# EAGLE schematic DC_brake (EAGLE 7.4.0)
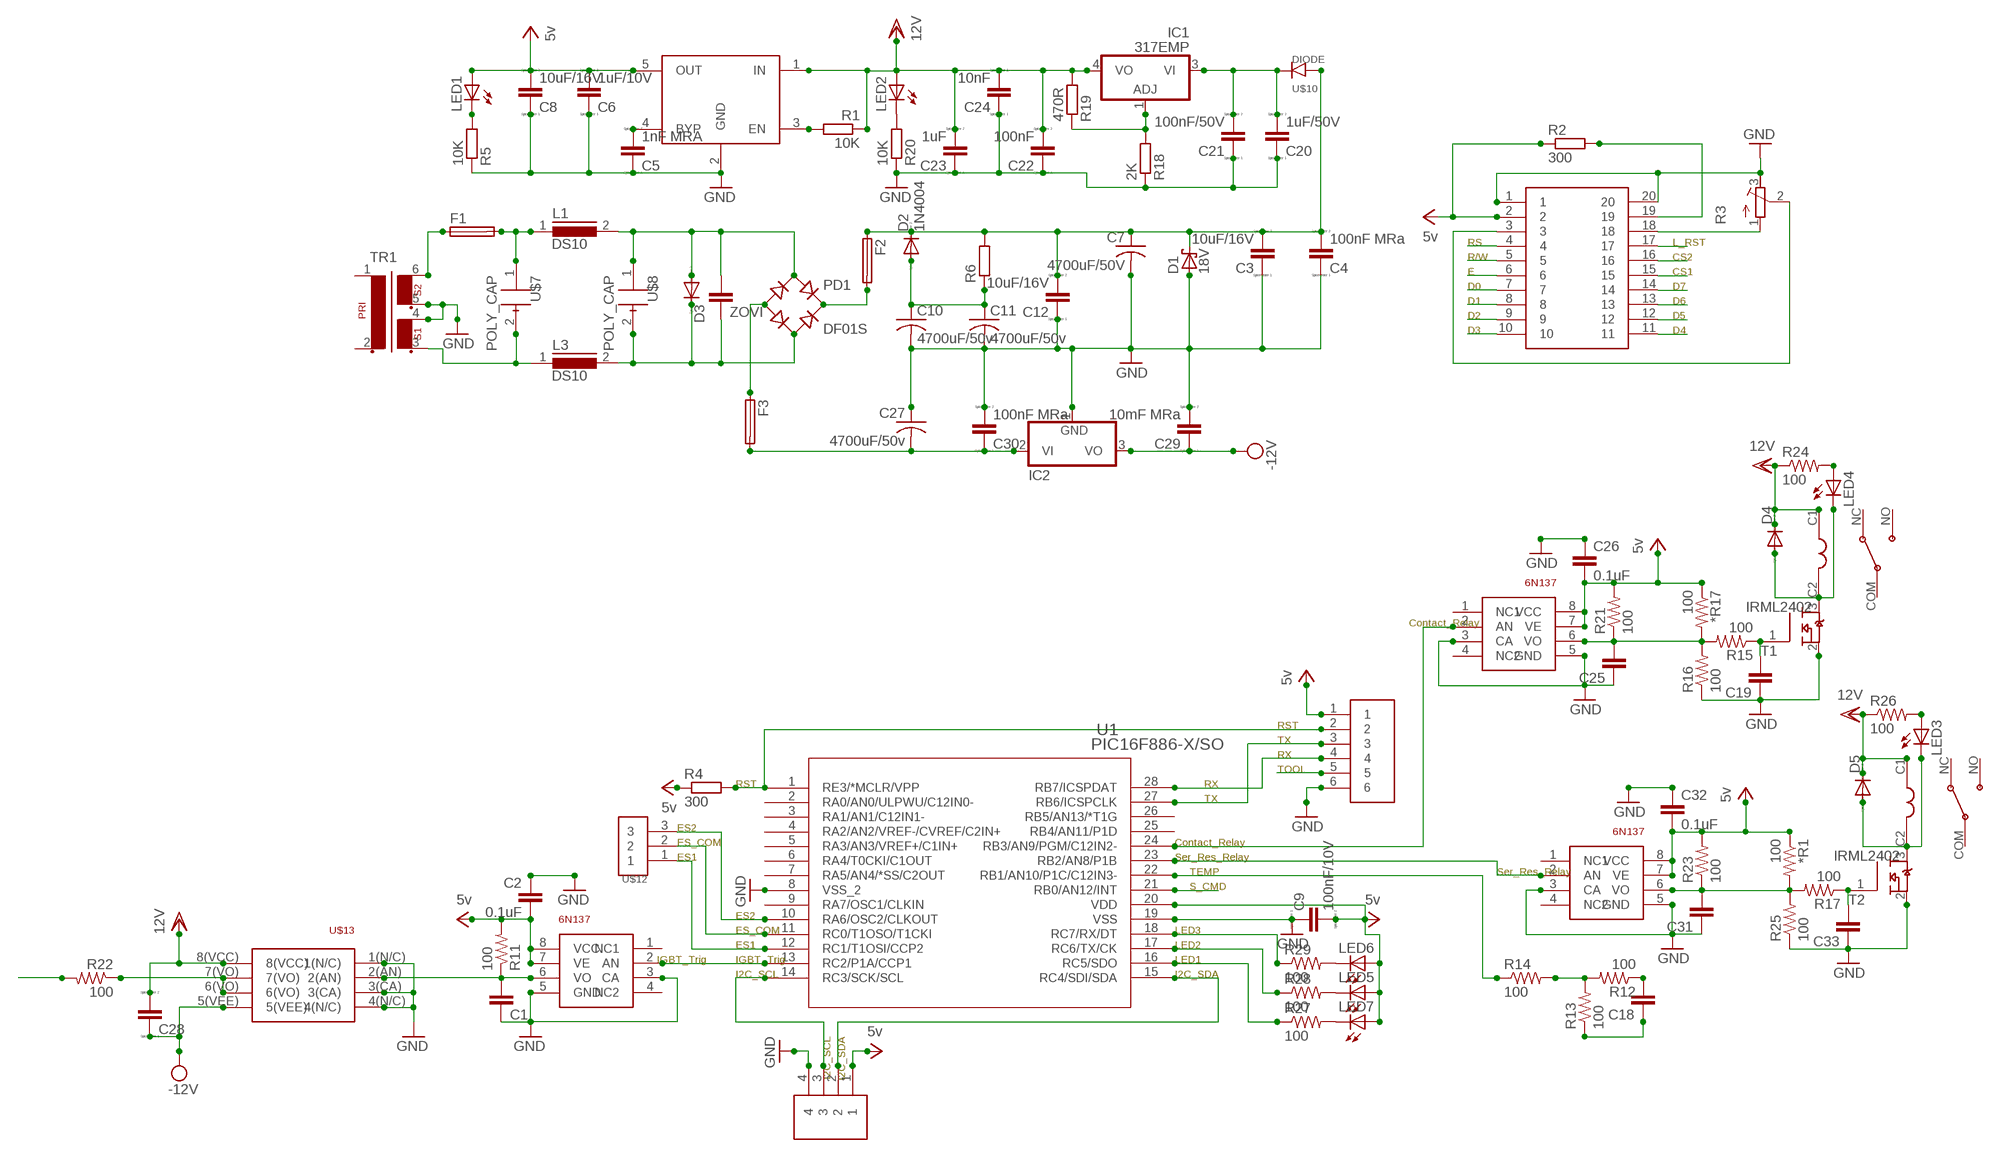
[diagram p0: schematic, sheet 1, part 1 of 2]
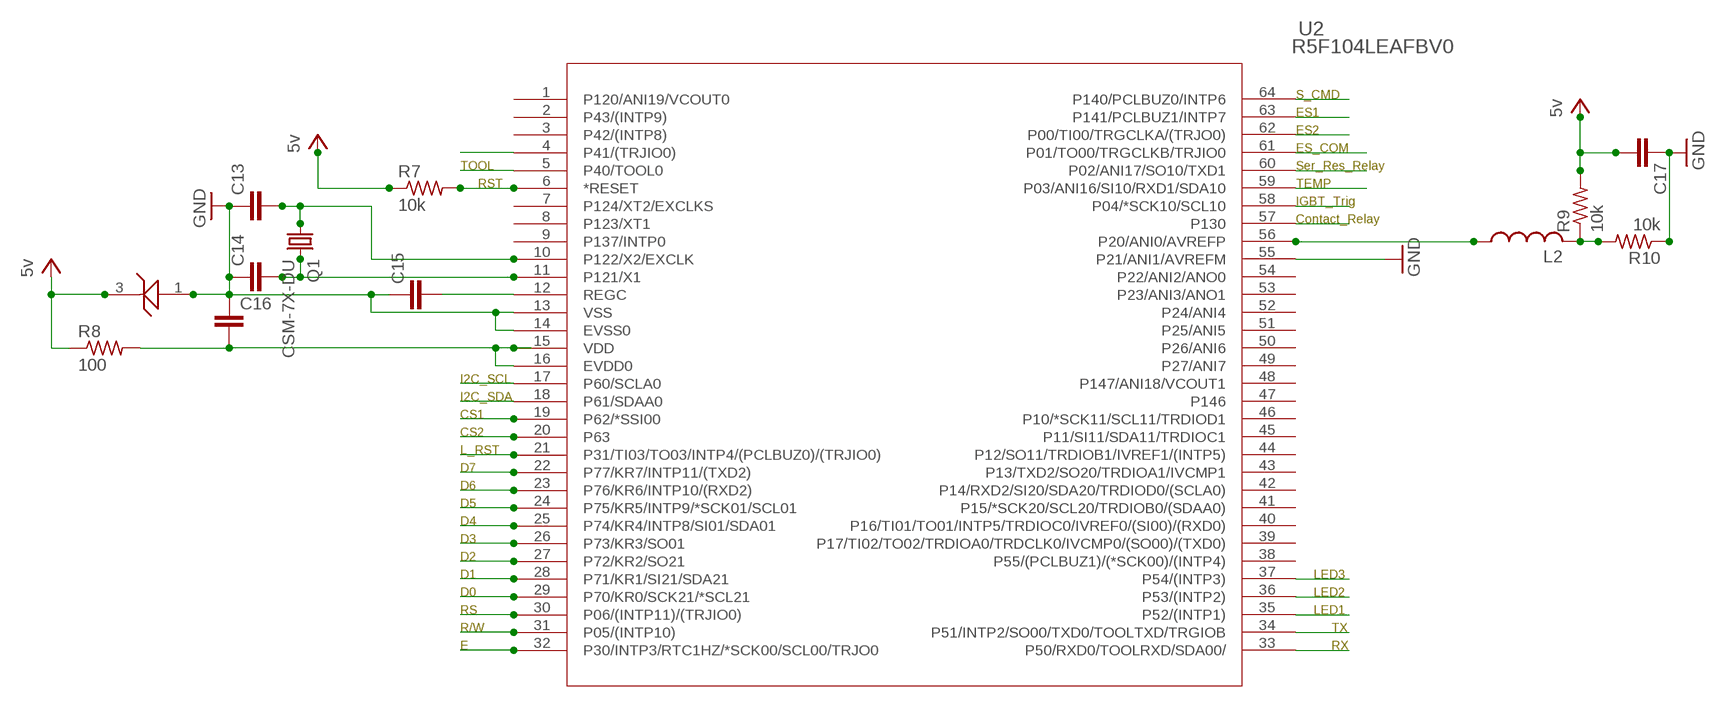
[diagram p1: schematic, sheet 1, part 2 of 2]

## Parts
*R1  100  R-US_R0603  [R0603]
*R17  100  R-US_R0603  [R0603]
C1  C-EUC0603  [C0603]
C2  0.1uF  C-EUC0603  [C0603]
C3  10uF/16V  CC1206  [C1206]
C4  100nF MRa  CC0603  [C0603]
C5  1nF MRA  CC0603  [C0603]
C6  1uF/10V  CC0603  [C0603]
C7  4700uF/50V  C-US050-075X075  [C050-075X075]
C8  10uF/16V  CC1206  [C1206]
C9  100nF/10V  CC0603  [C0603]
C10  4700uF/50v  C-US050-075X075  [C050-075X075]
C11  4700uF/50v  C-US050-075X075  [C050-075X075]
C12  10uF/16V  CC1206  [C1206]
C13  C-EUC0603  [C0603]
C14  C-EUC0603  [C0603]
C15  C-EUC0603  [C0603]
C16  C-EUC0603  [C0603]
C17  C-EUC0603  [C0603]
C18  C-EUC0603  [C0603]
C19  C-EUC0603  [C0603]
C20  1uF/50V  CC1206  [C1206]
C21  100nF/50V  CC0603  [C0603]
C22  100nF  CC0603  [C0603]
C23  1uF  CC0603  [C0603]
C24  10nF  CC0603  [C0603]
C25  C-EUC0603  [C0603]
C26  0.1uF  C-EUC0603  [C0603]
C27  4700uF/50v  C-US050-075X075  [C050-075X075]
C28  C  [C0805]
C29  10mF MRa  CC0603  [C0603]
C30  100nF MRa  CC0603  [C0603]
C31  C-EUC0603  [C0603]
C32  0.1uF  C-EUC0603  [C0603]
C33  C-EUC0603  [C0603]
D1  18V  SCHOTTKY-DIODESMC  [SMC]
D2  1N4004  [DO41-10]
D3  1N4933  [DO41-10]
D4  DIODE-DO214AC  [DO214AC]
D5  DIODE-DO214AC  [DO214AC]
F1  19560  [19560]
F2  19560  [19560]
F3  19560  [19560]
IC1  317EMP  [SOT223]
IC2  7908T  [TO220H]
L1  DS10  [DS10]
L2  L-USL4035M  [L4035M]
L3  DS10  [DS10]
LED1  LEDSML1206  [SML1206]
LED2  LEDSML1206  [SML1206]
LED3  LED3MM  [LED3MM]
LED4  LED3MM  [LED3MM]
LED5  LED3MM  [LED3MM]
LED6  LED3MM  [LED3MM]
LED7  LED3MM  [LED3MM]
PD1  DF01S  DBLS201G  [DBS]
Q1  CSM-7X-DU  [CSM-7X-DU]
R1  10K  R-EU_R0603  [R0603]
R2  300  R-EU_R0603  [R0603]
R3  R-TRIMM4G/J  [RTRIM4G/J]
R4  300  R-EU_R0603  [R0603]
R5  10K  R-EU_R0603  [R0603]
R6  R-EU_0411/12  [0411/12]
R7  10k  R-US_R0603  [R0603]
R8  100  R-US_R0603  [R0603]
R9  10k  R-US_R0603  [R0603]
R10  10k  R-US_R0603  [R0603]
R11  100  R-US_R0603  [R0603]
R12  100  R-US_R0603  [R0603]
R13  100  R-US_R0603  [R0603]
R14  100  R-US_R0603  [R0603]
R15  100  R-US_R0603  [R0603]
R16  100  R-US_R0603  [R0603]
R17  100  R-US_R0603  [R0603]
R18  2K  R-EU_R0603  [R0603]
R19  470R  R-EU_R0603  [R0603]
R20  10K  R-EU_R0603  [R0603]
R21  100  R-US_R0603  [R0603]
R22  100  R-US_R0603  [R0603]
R23  100  R-US_R0603  [R0603]
R24  100  R-US_R0603  [R0603]
R25  100  R-US_R0603  [R0603]
R26  100  R-US_R0603  [R0603]
R27  100  R-US_R0603  [R0603]
R28  100  R-US_R0603  [R0603]
R29  100  R-US_R0603  [R0603]
T1  IRML2402  [IRML2402]
T2  IRML2402  [IRML2402]
TR1  VR04,5-2  [VR04,5-2]
U1  PIC16F886-X/SO  PIC16F883-X/SO  [SOIC28-W_MC]
U2  R5F104LEAFBV0  [LQFP64_10X10]
U$1  MIC5205-5.YMS  [SMD]
U$2  SM20B-SRDS-G-TF  [SM20B-SRDS-G-TF]
U$3  6N137  [6N137]
U$4  6PIN  [6PIN]
U$5  ZENER  [ZENER]
U$6  4PIN  [4PIN]
U$7  POLY_CAP  [POL_CAP]
U$8  POLY_CAP  [POL_CAP]
U$9  RELAY  [RELAY]
U$10  DIODE  [DIODE]
U$11  6N137  [6N137]
U$12  3PIN  [3PIN]
U$13  HCPL-3120  [HCPL-3120]
U$14  6N137  [6N137]
U$15  RELAY  [RELAY]
ZOVI  C5/7.2  [C5B7.2]

## Nets
CONTACT_RELAY: U1.24(RB3/AN9/PGM/C12IN2-) U2.57(P130) U$11.2(AN)
CS1: U$2.15
CS2: U$2.16
D0: U2.29(P70/KR0/SCK21/*SCL21) U$2.7
D1: U2.28(P71/KR1/SI21/SDA21) U$2.8
D2: U2.27(P72/KR2/SO21) U$2.9
D3: U2.26(P73/KR3/SO01) U$2.10
D4: U2.25(P74/KR4/INTP8/SI01/SDA01) U$2.11
D5: U2.24(P75/KR5/INTP9/*SCK01/SCL01) U$2.12
D6: U2.23(P76/KR6/INTP10/(RXD2)) U$2.13
D7: U2.22(P77/KR7/INTP11/(TXD2)) U$2.14
ES1: U1.12(RC1/T1OSI/CCP2) U2.63(P141/PCLBUZ1/INTP7) U$12.1
ES2: U1.10(RA6/OSC2/CLKOUT) U2.62(P00/TI00/TRGCLKA/(TRJO0)) U$12.3
ES_COM: U1.11(RC0/T1OSO/T1CKI) U2.61(P01/TO00/TRGCLKB/TRJIO0) U$12.2
GND: C1.1 C2.1 C3.1 C4.1 C5.1 C6.1 C7.2 C8.1 C9.1 C10.2 C11.2 C12.1 C13.1 C14.1 C15.1 C16.1 C17.1 C19.1 C20.1 C21.1 C22.1 C23.1 C24.1 C25.1 C26.1 C27.1 C29.2 C31.1 C32.1 C33.1 D1.A IC2.1(GND) R3.3(E) R5.1 R10.1 R16.1 R18.1 R20.1 R25.1 T1.2(S1) T2.2(S1) TR1.4 TR1.5 U1.8(VSS_2) U1.19(VSS) U2.13(VSS) U2.14(EVSS0) U2.55(P21/ANI1/AVREFM) U$1.2(GND) U$2.1 U$2.20 U$3.3(CA) U$3.5(GND) U$4.6 U$5.1 U$6.4 U$11.3(CA) U$11.5(GND) U$13.1(N/C) U$13.3(CA) U$13.4(N/C) U$14.3(CA) U$14.5(GND)
I2C_SCL: U1.14(RC3/SCK/SCL) U2.17(P60/SCLA0) U$6.3
I2C_SDA: U1.15(RC4/SDI/SDA) U2.18(P61/SDAA0) U$6.2
IGBT_TRIG: U1.13(RC2/P1A/CCP1) U2.58(P04/*SCK10/SCL10) U$2.6 U$3.2(AN)
L_RST: U$2.17
LED1: R27.1 U1.16(RC5/SDO) U2.35(P52/(INTP1))
LED2: R28.1 U1.17(RC6/TX/CK) U2.36(P53/(INTP2))
LED3: R29.1 U1.18(RC7/RX/DT) U2.37(P54/(INTP3))
N$1: C30.2
N$2: C5.2 U$1.4(BYP)
N$3: F1.2 L1.1 U$7.1
N$4: R1.2 U$1.3(EN)
N$5: L3.1 TR1.3 U$7.2
N$6: F1.1 TR1.6
N$7: R3.2(S) U$2.3
N$8: R3.1(A) U$2.18
N$9: C18.1 R13.1
N$10: C10.1 C11.1 D2.A R6.1
N$11: U2.4(P41/(TRJIO0))
N$13: C3.2 C4.2 C7.1 C12.2 D1.C D2.C F2.1 R6.2 U$10.-
N$14: LED1.C R5.2
N$15: C13.2 Q1.1 U2.10(P122/X2/EXCLK)
N$16: C14.2 Q1.2 U2.11(P121/X1)
N$17: C16.2 R8.2 U2.15(VDD) U2.16(EVDD0)
N$18: C15.2 U2.12(REGC)
N$19: U2.21(P31/TI03/TO03/INTP4/(PCLBUZ0)/(TRJIO0))
N$20: U2.20(P63)
N$21: R2.2 U$2.19
N$22: U2.19(P62/*SSI00)
N$23: U2.30(P06/(INTP11)/(TRJIO0))
N$24: U2.31(P05/(INTP10))
N$25: U2.32(P30/INTP3/RTC1HZ/*SCK00/SCL00/TRJO0)
N$26: L2.2 R9.1 R10.2
N$27: D3.A L1.2 PD1.AC1 U$8.1 ZOVI.2
N$28: D3.C L3.2 PD1.AC2 U$8.2 ZOVI.1
N$29: L2.1 U2.56(P20/ANI0/AVREFP)
N$31: C1.2 R11.1 U$3.6(VO) U$13.2(AN)
N$32: R22.2
N$33: C18.2 R12.1
N$35: F2.2 PD1.+
N$36: F3.1 PD1.-
N$37: R12.2 R13.2 R14.2
N$38: C19.2 R15.1 T1.1(G1)
N$39: D4.A LED4.K(C) T1.3(D1) U$9.C2
N$40: C33.2 R17.1 T2.1(G1)
N$41: *R17.2 C25.2 R15.2 R16.2 R21.1 U$11.6(VO)
N$42: LED2.C R20.2
N$43: IC1.1(ADJ) R18.2 R19.1
N$44: C20.2 C21.2 IC1.3(VI) U$10.+
N$45: C27.2 C30.1 F3.2 IC2.2(VI)
N$47: R22.1 U$13.6(VO) U$13.7(VO)
N$48: *R1.2 C31.2 R17.2 R23.1 R25.2 U$14.6(VO)
N$50: LED4.A R24.2
N$51: D5.A LED3.K(C) T2.3(D1) U$15.C2
N$52: LED7.K(C) R27.2
N$53: LED3.A R26.2
N$54: LED5.K(C) R28.2
N$55: LED6.K(C) R29.2
R/W: U$2.5
RS: U$2.4
RST: R4.2 R7.2 U1.1(RE3/*MCLR/VPP) U2.6(*RESET) U$4.2
RX: U1.28(RB7/ICSPDAT) U2.33(P50/RXD0/TOOLRXD/SDA00/) U$4.4
S_CMD: U1.21(RB0/AN12/INT) U2.64(P140/PCLBUZ0/INTP6)
SER_RES_RELAY: U1.23(RB2/AN8/P1B) U2.60(P02/ANI17/SO10/TXD1) U$14.2(AN)
TEMP: R14.1 U1.22(RB1/AN10/P1C/C12IN3-) U2.59(P03/ANI16/SI10/RXD1/SDA10)
TOOL: U2.5(P40/TOOL0) U$4.5
TX: U1.27(RB6/ICSPCLK) U2.34(P51/INTP2/SO00/TXD0/TOOLTXD/TRGIOB) U$4.3
VCC: *R1.1 *R17.1 C2.2 C6.2 C8.2 C9.2 C17.2 C26.2 C32.2 LED1.A LED5.A LED6.A LED7.A R2.1 R4.1 R7.1 R8.1 R9.2 R11.2 R21.2 R23.2 U1.20(VDD) U$1.5(OUT) U$2.2 U$3.7(VE) U$3.8(VCC) U$4.1 U$5.3 U$6.1 U$11.7(VE) U$11.8(VCC) U$14.7(VE) U$14.8(VCC) ; supply symbol labelled 5v
VDD: C22.2 C23.2 C24.2 C28.1 C28.2 C29.1 D4.C D5.C IC1.4(VO) IC2.3(VO) LED2.A R1.1 R19.2 R24.1 R26.1 U$1.1(IN) U$9.C1 U$13.5(VEE) U$13.8(VCC) U$15.C1 ; supply symbol labelled 12V, -12V
Unconnected: TR1.1 TR1.2 U1.2(RA0/AN0/ULPWU/C12IN0-) U1.3(RA1/AN1/C12IN1-) U1.4(RA2/AN2/VREF-/CVREF/C2IN+) U1.5(RA3/AN3/VREF+/C1IN+) U1.6(RA4/T0CKI/C1OUT) U1.7(RA5/AN4/*SS/C2OUT) U1.9(RA7/OSC1/CLKIN) U1.25(RB4/AN11/P1D) U1.26(RB5/AN13/*T1G) U2.1(P120/ANI19/VCOUT0) U2.2(P43/(INTP9)) U2.3(P42/(INTP8)) U2.7(P124/XT2/EXCLKS) U2.8(P123/XT1) U2.9(P137/INTP0) U2.38(P55/(PCLBUZ1)/(*SCK00)/(INTP4)) U2.39(P17/TI02/TO02/TRDIOA0/TRDCLK0/IVCMP0/(SO00)/(TXD0)) U2.40(P16/TI01/TO01/INTP5/TRDIOC0/IVREF0/(SI00)/(RXD0)) U2.41(P15/*SCK20/SCL20/TRDIOB0/(SDAA0)) U2.42(P14/RXD2/SI20/SDA20/TRDIOD0/(SCLA0)) U2.43(P13/TXD2/SO20/TRDIOA1/IVCMP1) U2.44(P12/SO11/TRDIOB1/IVREF1/(INTP5)) U2.45(P11/SI11/SDA11/TRDIOC1) U2.46(P10/*SCK11/SCL11/TRDIOD1) U2.47(P146) U2.48(P147/ANI18/VCOUT1) U2.49(P27/ANI7) U2.50(P26/ANI6) U2.51(P25/ANI5) U2.52(P24/ANI4) U2.53(P23/ANI3/ANO1) U2.54(P22/ANI2/ANO0) U$3.1(NC1) U$3.4(NC2) U$9.COM U$9.NC U$9.NO U$11.1(NC1) U$11.4(NC2) U$14.1(NC1) U$14.4(NC2) U$15.COM U$15.NC U$15.NO

## Notes on the sheet
- RS | L_RST
- R/W | CS2
- E | CS1
- D0 | D7
- D1 | D6
- D2 | D5
- D3 | D4
- S_CMD
- ES1
- ES2
- ES_COM
- TOOL | Ser_Res_Relay
- RST | TEMP
- IGBT_Trig
- Contact_Relay
- Contact_Relay
- I2C_SCL
- I2C_SDA
- CS1
- CS2
- RST | L_RST
- TX | D7
- RX | D6
- TOOL | D5
- RST | RX | D4
- TX | D3
- D2
- ES2 | D1 | LED3
- ES_COM | Contact_Relay | D0 | LED2
- ES1 | Ser_Res_Relay | RS | LED1
- TEMP | Ser_Res_Relay | R/W | TX
- S_CMD | E | RX
- ES2
- ES_COM | LED3
- ES1 | LED2
- IGBT_Trig | IGBT_Trig | LED1
- I2C_SCL | I2C_SDA
- I2C_SCL | I2C_SDA

## Library data of the parts
*R1 *R17 R7-R17 R21-R29 = resistor:R-US_: RESISTOR, American symbol
C1 C2 C13-C19 C25 C26 C31-C33 = rcl:C-EU: CAPACITOR, European symbol
C3-C6 C8 C9 C12 C20-C24 C28-C30 = eagle-ltspice:C: CAPACITOR, European symbol; SPICEMODEL: NONE; SPICEPREFIX: C
C7 C10 C11 C27 = rcl:C-US: CAPACITOR, American symbol
D1 = diode:SCHOTTKY-DIODE: Schottky Diode
D2 = diode:1N4004: DIODE general purpose rectifier, 1 A
D3 = diode:1N4933: DIODE fast recovery rectifier, 1A
D4 D5 = diode:DIODE-: DIODE
F1-F3 = fuse:19560: FUSE HOLDER TR5, Wickmann; MPN: 56000001009; OC_FARNELL: 1185363; OC_NEWARK: 15P8392
IC1 = linear:*317: Positive VOLTAGE REGULATOR
IC2 = linear:79*: Negative VOLTAGE REGULATOR
L1 L3 = inductors:DS10: INDUCTOR
L2 = rcl:L-US: INDUCTOR, American symbol
LED1-LED7 = led:LED: LED OSRAM: - CHIPLED LG R971, LG N971, LY N971, LG Q971, LY Q971, LO R971, LY R971 LH N974, LH R974 LS Q976, LO Q976, LY Q976 LO Q996 - Hyper CHIPLED LW Q18S LB Q993, LB Q99A, LB R99A - SideLED LS A670, LO A670, LY A670, LG A670, LP A670 LB A673, LV A673, LT A673, LW A673 LH A674 LY A675 LS A676, LA A676, LO A676, LY A676, LW A676 LS A679, LY A679, LG A679 - Hyper Micro SIDELED® LS Y876, LA Y876, LO Y876, LY Y876 LT Y87S - SmartLED LW L88C, LW L88S LB L89C, LB L89S, LG L890 LS L89K, LO L89K, LY L89K LS L896, LA L896, LO L896, LY L896 - TOPLED LS T670, LO T670, LY T670, LG T670, LP T670 LSG T670, LSP T670, LSY T670, LOP T670, LYG T670 LG T671, LOG T671, LSG T671 LB T673, LV T673, LT T673, LW T673 LH T674 LS T676, LA T676, LO T676, LY T676, LB T676, LH T676, LSB T676, LW T676 LB T67C, LV T67C, LT T67C, LS T67K, LO T67K, LY T67K, LW E67C LS E67B, LA E67B, LO E67B, LY E67B, LB E67C, LV E67C, LT E67C LW T67C LS T679, LY T679, LG T679 LS T770, LO T770, LY T770, LG T770, LP T770 LB T773, LV T773, LT T773, LW T773 LH T774 LS E675, LA E675, LY E675, LS T675 LS T776, LA T776, LO T776, LY T776, LB T776 LHGB T686 LT T68C, LB T68C - Hyper Mini TOPLED® LB M676 - Mini TOPLED Santana® LG M470 LS M47K, LO M47K, LY M47K Source: http://www.osram.convergy.de LUXEON: - LUMILED® LXK2-PW12-R00, LXK2-PW12-S00, LXK2-PW14-U00, LXK2-PW14-V00 LXK2-PM12-R00, LXK2-PM12-S00, LXK2-PM14-U00 LXK2-PE12-Q00, LXK2-PE12-R00, LXK2-PE12-S00, LXK2-PE14-T00, LXK2-PE14-U00 LXK2-PB12-K00, LXK2-PB12-L00, LXK2-PB12-M00, LXK2-PB14-N00, LXK2-PB14-P00, LXK2-PB14-Q00 LXK2-PR12-L00, LXK2-PR12-M00, LXK2-PR14-Q00, LXK2-PR14-R00 LXK2-PD12-Q00, LXK2-PD12-R00, LXK2-PD12-S00 LXK2-PH12-R00, LXK2-PH12-S00 LXK2-PL12-P00, LXK2-PL12-Q00, LXK2-PL12-R00 Source: www.luxeon.com KINGBRIGHT: KA-3528ASYC Source: www.kingbright.com
PD1 = rectifier:DB?*G: Single Phase 1.0 AMP Glass Passivated Bridge Rectifier Taiwan Semiconductor Co.,Ltd. - TSC Source: http://www.taiwansemi.com/TSCbig5/ezcatfiles/cust/img/img/db101g.pdf http://www.ts.com.tw/db/pictures/modules/PDT/PDT060207001/DBLS201G.pdf
Q1 = crystal:CSM-7X-DU: SMD CRYSTAL Source: www.ecsxtal.com .. Crystal 3.6864MHz CSM_7X_DU.PDF; OC_FARNELL: unknown; OC_NEWARK: unknown
R1 R2 R4 R5 R18-R20 = rcl:R-EU_: RESISTOR, European symbol
R3 = rcl:R-TRIMM: Trimm resistor
R6 = resistor:R-EU_: RESISTOR, European symbol
T1 T2 = irlml2402:IRML2402
TR1 = trafo:VR04,5-2: TRANSFORMER 1 primary winding, 2 secondary windings, mounting holes BLOCK
U1 = pic16f883:PIC16F883-X/SO
U2 = r5f100lefb:R5F104LEAFBV0; 16-BITPWM: 10; 16-BITTIMERS: 7; 32KHZSUBCLOCK: Y; 8-BITPWM: 0; 8-BITTIMERS: 0; BIT-NESS: 16 Bit; CAN: 0; DATASHEETLINK: http://www.renesas.com/request?SCREEN_ID=ViewDocumentSearch&EXECUTE_ACTION=search&DOCUMENT_TYPE=VXNlcidzIE1hbnVhbDogSGFyZHdhcmU=&KEY_WORD=R5F104LEAFB#V0; DMACHANNELS: 0; DTC: 24; EXTERNALDATABUS: -; EXTERNALINTERRUPTS: 13; FAMILY: RL78; FPU: -; GROUP: 64; I2C: 7; IRDA: -; LIN: 1; LOWVOLTAGEDETECT: Y; MANUFACTURER_PART_NUMBER: R5F104LEAFB#V0; MOTORCONTROLPWMTIMER: Y; ON-CHIPOSCILLATOR: Y; ONCHIPDEBUG: Y; OP-AMPS: 0; OSCILLATIONSTOPDETECT: -; PACKAGE: LQFP; PACKAGECODE: GB-UEU; PINCOUNT: 64; PLL: -; POWERONRESET: Y; REALTIMECLOCK: Y; RENESASPACKAGECODE: P64GB-50-UEU-1; SERIES: RL78/G14; TEMPMAX: 85; TEMPMIN: -40; USART: 3; VCCMAX: 5.5; VCCMIN: 1.6; VENDOR: Renesas; WATCHDOGTIMERS: 1
U$1 = mic5205_5.0:MIC5205-5.YMS
U$2 = SM20B-SRDS-G-TF:SM20B-SRDS-G-TF
U$3 U$11 U$14 = 6n137:6N137
U$4 = 6pin:6PIN
U$5 = zener:ZENER
U$6 = 4pin:4PIN
U$7 U$8 = poly_cap:POLY_CAP
U$9 U$15 = relay:RELAY
U$10 = diode:DIODE
U$12 = 3pin:3PIN
U$13 = hcpl_3120:HCPL-3120
ZOVI = capacitor-wima:C: CAPACITOR naming: grid - package width